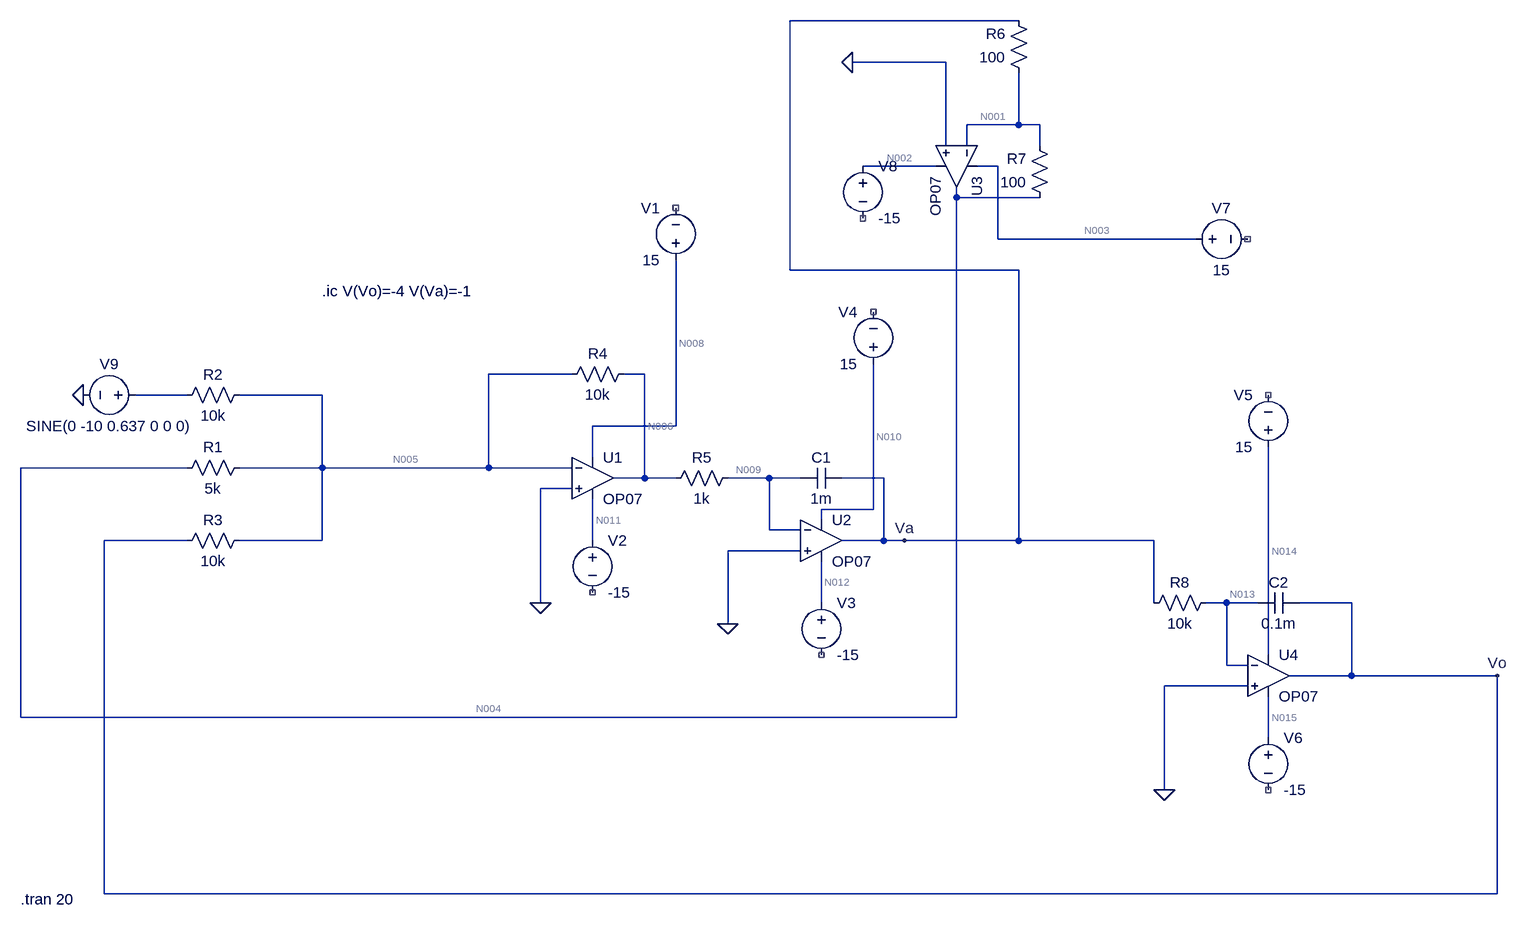
[diagram p0: schematic Draft12.asc]
* Draft12.asc
XU1 0 N005 N008 N011 N006 LT1001  ; OP07, pins In+ In- V+ V- OUT
XU2 0 N009 N010 N012 Va LT1001  ; OP07, pins In+ In- V+ V- OUT
XU3 0 N001 N003 N002 N004 LT1001  ; OP07, pins In+ In- V+ V- OUT
XU4 0 N013 N014 N015 Vo LT1001  ; OP07, pins In+ In- V+ V- OUT
R1 N005 N004 5k
R2 N005 N007 10k
R3 N005 Vo 10k
R4 N006 N005 10k
R5 N009 N006 1k
R6 N001 Va 100
R7 N004 N001 100
R8 N013 Va 10k
C1 Va N009 1m
C2 Vo N013 0.1m
V9 N007 0 SINE(0 -10 0.637 0 0 0)
V2 N011 NC_01 -15
V3 N012 NC_02 -15
V6 N015 NC_03 -15
V8 N002 NC_04 -15
V1 N008 NC_05 15
V4 N010 NC_06 15
V5 N014 NC_07 15
V7 N003 NC_08 15
.tran 20
.ic V(Vo)=-4 V(Va)=-1
.lib LTC.lib
.backanno
.end

* Results of the author's LTspice run, read from the files saved beside the schematic
* Operating Point, zero values left out:
*   V(n005) = -1.343 V
*   V(n008) = -1.197 V
*   V(n011) = -970.9 mV
*   V(n006) = -1.197 V
*   V(n009) = -1.182 V
*   V(n010) = -1 V
*   V(n012) = -774.5 mV
*   V(va) = -1 V
*   V(n001) = -1.007 V
*   V(n003) = -1.013 V
*   V(n002) = -787.6 mV
*   V(n004) = -1.013 V
*   V(n013) = -999.9 mV
*   V(n014) = -4 V
*   V(n015) = -3.772 V
*   V(vo) = -4 V
*   I(R8) = 13.49 nA
*   I(R7) = -65.71 µA
*   I(R6) = -65.68 µA
*   I(R5) = 14.43 µA
*   I(R4) = 14.6 µA
*   I(R3) = 265.7 µA
*   I(R2) = -134.3 µA
*   I(R1) = -65.87 µA
*   I(V9) = -134.3 µA
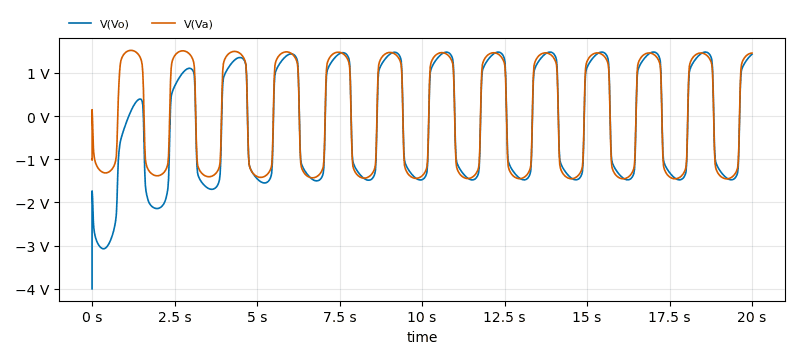
[diagram p1: Transient Analysis of Draft12.asc, plotted from the saved traces]
* Transient Analysis, 1 run:
*   V(Vo): min -4 V, max 1.48 V, average -198.3 mV, rms 1.397 V, last 1.43 V
*   V(Va): min -1.455 V, max 1.52 V, average 76.74 µV, rms 1.317 V, last 1.458 V